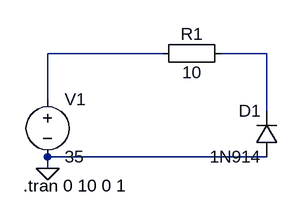
[diagram p0: schematic Verscuh1 Schaltung 3.asc]
Verscuh1 Schaltung 3.asc, the LTspice schematic file:
Version 4
SHEET 1 880 680
WIRE 128 80 -32 80
WIRE 272 80 208 80
WIRE -32 144 -32 80
WIRE 272 160 272 80
WIRE 272 224 -32 224
WIRE -32 240 -32 224
FLAG -32 240 0
SYMBOL Misc\\EuropeanResistor 224 64 R90
WINDOW 0 5 56 VBottom 2
WINDOW 3 27 56 VTop 2
SYMATTR InstName R1
SYMATTR Value 10
SYMBOL diode 288 224 R180
WINDOW 0 24 64 Left 2
WINDOW 3 24 0 Left 2
SYMATTR InstName D1
SYMATTR Value 1N914
SYMBOL voltage -32 128 R0
SYMATTR InstName V1
SYMATTR Value 35
TEXT -66 264 Left 2 !.tran 0 10 0 1

The netlist it stands for:
* Verscuh1 Schaltung 3.asc
R1 N002 N001 10
D1 0 N002 1N914
V1 N001 0 35
.model D D
.lib standard.dio
.tran 0 10 0 1
.backanno
.end